# EAGLE design PCB-PWR-DIST (EAGLE 6.2)
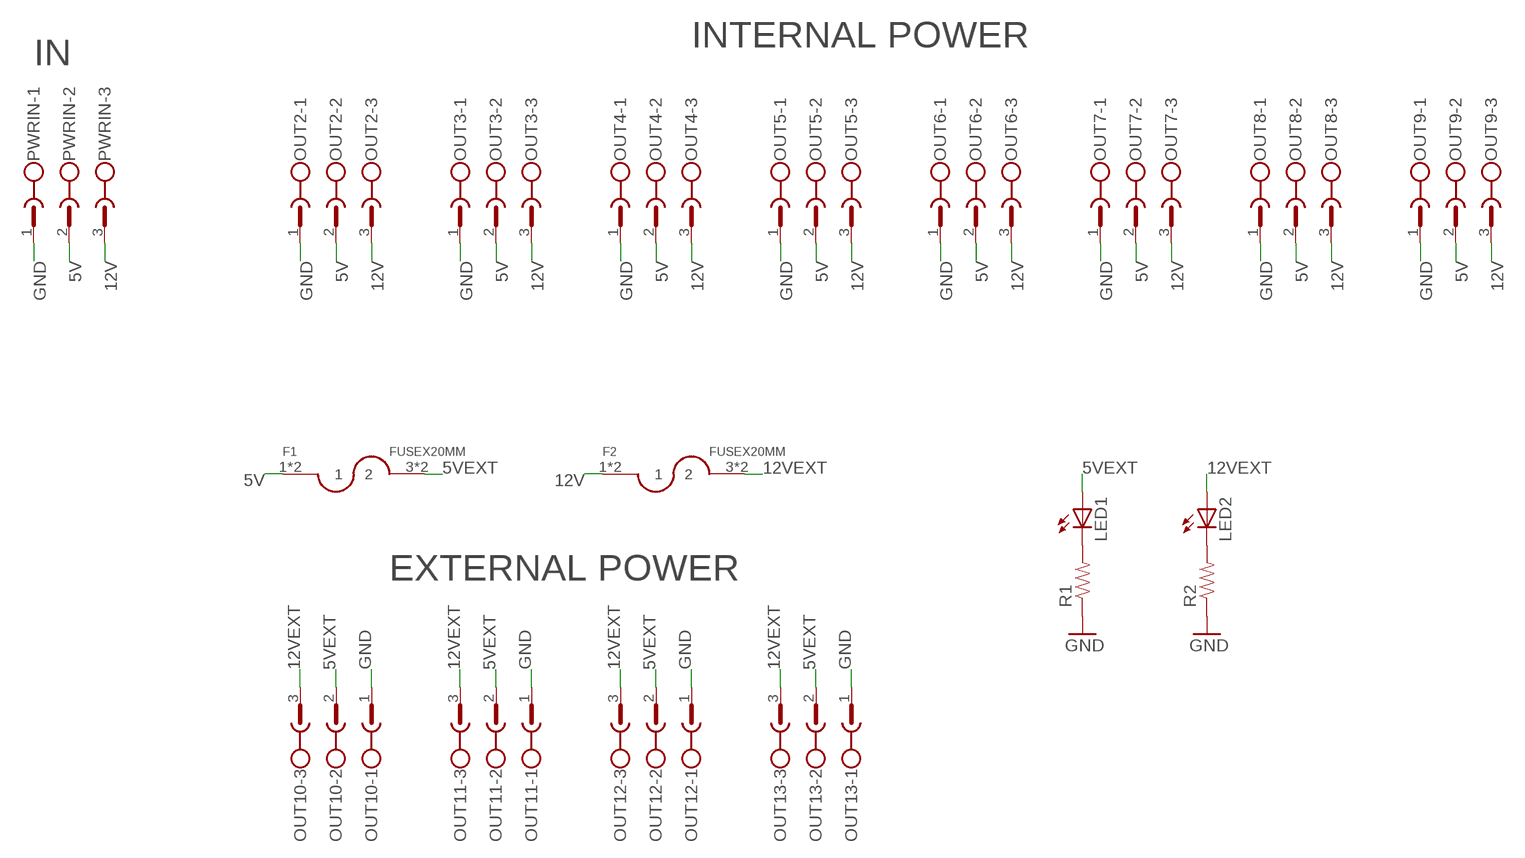
[diagram p0: schematic, sheet 1]

## Parts
F1  FUSEX20MM  [FUSE_5MM]
F2  FUSEX20MM  [FUSE_5MM]
LED1  LED3MM  [LED3MM]
LED2  LED3MM  [LED3MM]
OUT2  CON1  MSTBV3  [MSTBV3]
OUT3  CON1  MSTBV3  [MSTBV3]
OUT4  CON1  MSTBV3  [MSTBV3]
OUT5  CON1  MSTBV3  [MSTBV3]
OUT6  CON1  MSTBV3  [MSTBV3]
OUT7  CON1  MSTBV3  [MSTBV3]
OUT8  CON1  MSTBV3  [MSTBV3]
OUT9  CON1  MSTBV3  [MSTBV3]
OUT10  CON1  MSTBV3  [MSTBV3]
OUT11  CON1  MSTBV3  [MSTBV3]
OUT12  CON1  MSTBV3  [MSTBV3]
OUT13  CON1  MSTBV3  [MSTBV3]
PWRIN  CON1  MSTBV3  [MSTBV3]
R1  RESISTORPTH-1/4W  [AXIAL-0.4]
R2  RESISTORPTH-1/4W  [AXIAL-0.4]

## Nets
5V [PWR]: F1.1 F1.2 OUT2.2 OUT3.2 OUT4.2 OUT5.2 OUT6.2 OUT7.2 OUT8.2 OUT9.2 PWRIN.2
5VEXT [PWR]: F1.3 F1.4 LED1.A OUT10.2 OUT11.2 OUT12.2 OUT13.2
12V [PWR]: F2.1 F2.2 OUT2.3 OUT3.3 OUT4.3 OUT5.3 OUT6.3 OUT7.3 OUT8.3 OUT9.3 PWRIN.3
12VEXT [PWR]: F2.3 F2.4 LED2.A OUT10.3 OUT11.3 OUT12.3 OUT13.3
GND [PWR]: OUT2.1 OUT3.1 OUT4.1 OUT5.1 OUT6.1 OUT7.1 OUT8.1 OUT9.1 OUT10.1 OUT11.1 OUT12.1 OUT13.1 PWRIN.1 R1.P$1 R2.P$1
N$1: LED1.K(C) R1.P$2
N$2: LED2.K(C) R2.P$2

## Notes on the sheet
- INTERNAL POWER
- IN
- EXTERNAL POWER

## Library data of the parts
F1 F2 = SKAARHOJ:FUSE
LED1 LED2 = SparkFun:LED: LEDs Standard schematic elements and footprints for 5mm, 3mm, 1206, and 0603 sized LEDs. 5mm - Spark Fun Electronics SKU : COM-00529 (and others)
OUT2-OUT13 PWRIN = con-phoenix-508:MSTBV3: PHOENIX; MPN: MSTBV 2,5/3-GF-5.08; OC_FARNELL: 1792793; OC_NEWARK: 69R9846
R1 R2 = SparkFun:RESISTOR: Resistor Basic schematic elements and footprints for 0603, 1206, and PTH resistors.

## Net classes
0 default: width 0.254 mm, drill 0.406 mm, clearance 0.254 mm
1 PWR: width 1.778 mm, clearance 0.61 mm

## Board
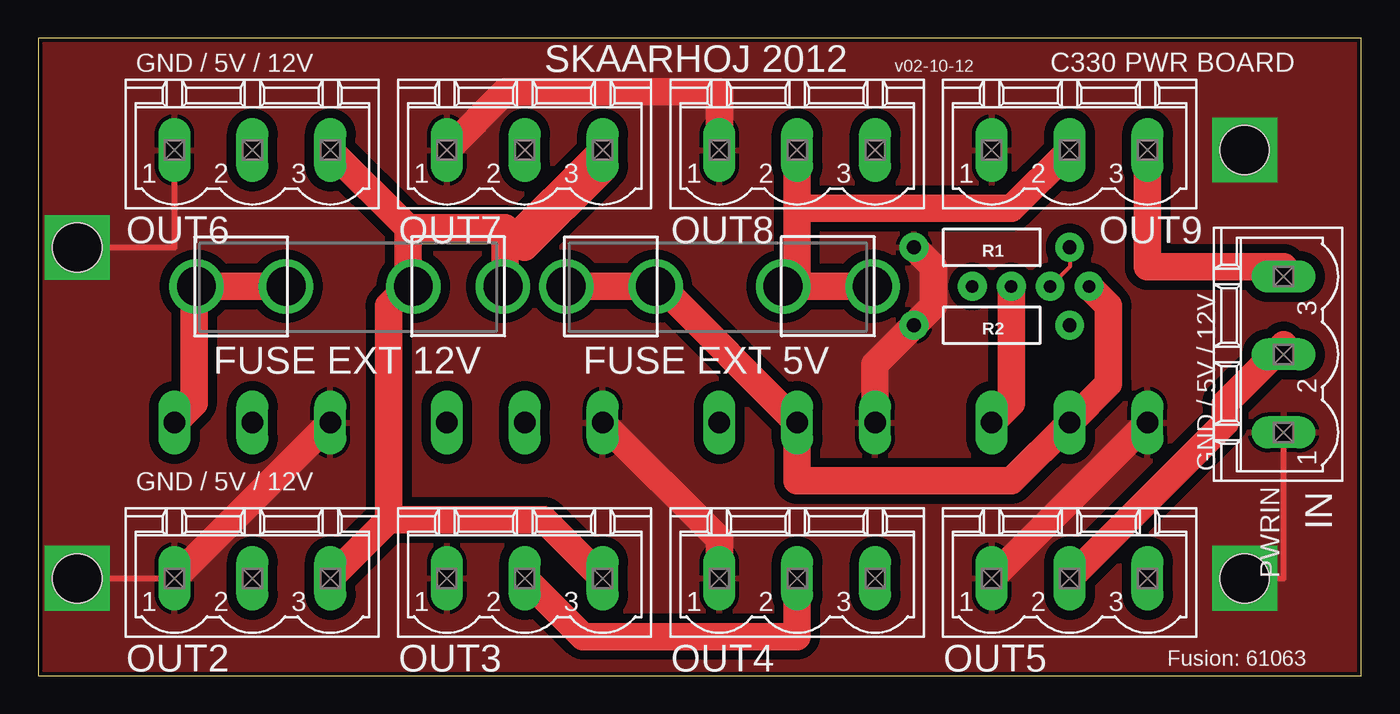
[diagram p1: board, top side]
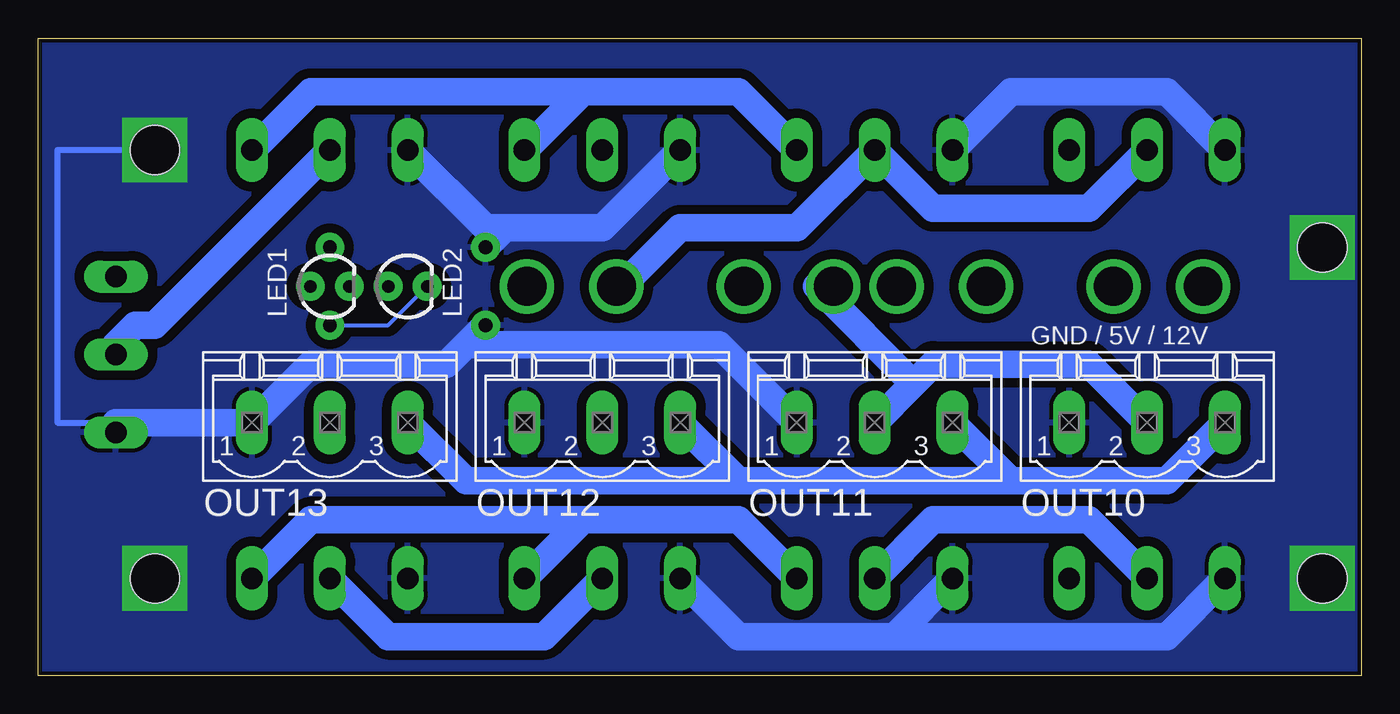
[diagram p2: board, bottom side, seen from below]

Size 86.34 x 41.58 mm. Coordinates in mm from the lower left corner, seen from the top.
Outline: 0,0 86.34,0 86.34,41.58 0,41.58 0,0
Copper layers (1*16): Top 0.035mm / dielectric 1.5mm / Bottom 0.035mm
Design rules: minimum track width 6mil, minimum drill 12mil, track to track 6mil, track to pad 6mil, pad to pad 6mil, via to via 6mil, smd to smd 0mil, copper to edge 10mil, drill to drill 10mil, minimum pad ring 10mil, minimum via ring 6mil, stop-mask expansion 2mil, vias tented up to drill 100mil, thermal gap 10mil
Holes 3.2 mm at 2.54,6.35 78.74,6.35 2.54,27.94 78.74,34.29

### Footprints (pad centres in the part's own frame; a part is rotated, then mirrored left to right if it is on the bottom)
FUSE_5MM = drill 2.54 pad 3.556: 1 0,-10; 2 0,-4.158; 3 0,4.158; 4 0,10
LED3MM = drill 0.813 pad 1.88: A -1.27,0; K 1.27,0
MSTBV3 = drill 1.397 long: 1 -5.08,0; 2 0,0; 3 5.08,0
AXIAL-0.4 = drill 0.9 pad 1.88: P$1 -5.08,0; P$2 5.08,0

### Placement (x,y rotation side)
F1  44.45,25.4 90 top
F2  20.32,25.4 90 top
LED1  67.31,25.4 0 bottom
LED2  62.23,25.4 0 bottom
OUT2  13.97,6.35 0 top
OUT3  31.75,6.35 0 top
OUT4  49.53,6.35 0 top
OUT5  67.31,6.35 0 top
OUT6  13.97,34.29 0 top
OUT7  31.75,34.29 0 top
OUT8  49.53,34.29 0 top
OUT9  67.31,34.29 0 top
OUT10  13.97,16.51 0 bottom
OUT11  31.75,16.51 0 bottom
OUT12  49.53,16.51 0 bottom
OUT13  67.31,16.51 0 bottom
PWRIN  81.28,20.95 90 top
R1  62.23,27.94 0 top
R2  62.23,22.86 0 top

### Tracks (layer width: path | path; a pad name or v marks a point on that pad's centre or on a via)
5V
  Top 1.778: OUT3.2 35.56,2.54 49.53,2.54 OUT4.2 | 49.53,25.4 49.53,30.48 | 49.53,30.48 OUT8.2 | 49.53,25.4 F1.1 | 49.53,25.4 F1.2 | OUT9.2 63.5,30.48 49.53,30.48 | OUT5.2 77.47,16.51 77.47,17.78 81.28,21.59 PWRIN.2
  Bottom 1.778: OUT2.2 17.78,10.16 27.94,10.16 OUT3.2 | OUT4.2 53.34,2.54 63.5,2.54 OUT5.2 | OUT9.2 78.74,22.86 80.01,22.86 81.28,21.59 PWRIN.2 | OUT6.2 17.78,30.48 27.94,30.48 OUT7.2 36.83,29.21 44.45,29.21 48.26,25.4 F1.2
5VEXT
  Top 1.778: LED1.A 69.85,24.13 69.85,19.05 OUT13.2 63.5,12.7 49.53,12.7 OUT12.2 40.64,25.4 F1.3 F1.4
  Bottom 1.778: OUT10.2 17.78,20.32 27.94,20.32 29.21,19.05 | OUT11.2 29.21,19.05 | 29.21,19.05 35.56,25.4 F1.4
12V
  Top 1.778: OUT9.3 72.39,26.67 81.28,26.67 PWRIN.3 | F2.1 30.48,25.4 30.48,27.94 OUT7.3 36.83,33.02 31.75,27.94 30.48,29.21 24.13,29.21 | 22.86,10.16 OUT2.3 | 22.86,10.16 22.86,24.13 24.13,25.4 | 24.13,29.21 OUT6.3 | 24.13,25.4 24.13,29.21 | 24.13,25.4 F2.2 | OUT3.3 33.02,10.16 22.86,10.16
  Bottom 1.778: 50.8,38.1 OUT8.3 | 50.8,38.1 40.64,38.1 OUT7.3 | OUT9.3 68.58,38.1 50.8,38.1 | 50.8,10.16 OUT4.3 | 50.8,10.16 40.64,10.16 OUT3.3 | OUT5.3 68.58,10.16 50.8,10.16
12VEXT
  Top 1.778: LED2.A 63.5,17.78 OUT13.3 | OUT10.3 10.16,17.78 10.16,25.4 F2.4 F2.3
  Bottom 1.778: 22.86,12.7 OUT11.3 | 22.86,12.7 12.7,12.7 OUT10.3 | 40.64,12.7 OUT12.3 | 22.86,12.7 40.64,12.7 | OUT13.3 58.42,12.7 40.64,12.7
GND  (via drill 3.2)
  Top 0.406: v2.54,27.94 8.89,27.94 OUT6.1 | v2.54,6.35 OUT2.1 | v78.74,6.35 81.28,6.35 PWRIN.1
  Top 1.778: OUT10.1 OUT2.1 | OUT11.1 44.45,8.89 OUT4.1 | OUT13.1 OUT5.1 | OUT12.1 54.61,20.32 R2.P$1 58.42,24.13 58.42,26.67 R1.P$1 | OUT7.1 30.48,38.1 44.45,38.1 OUT8.1
  Bottom 0.406: v78.74,34.29 85.09,34.29 85.09,16.51 81.28,16.51
  Bottom 1.778: 30.48,2.54 OUT3.1 | 30.48,2.54 40.64,2.54 OUT4.1 | OUT2.1 12.7,2.54 30.48,2.54 | PWRIN.1 81.28,16.51 OUT13.1 68.58,20.32 59.69,20.32 58.42,21.59 | OUT6.1 12.7,38.1 22.86,38.1 OUT7.1 | OUT8.1 49.53,29.21 55.88,29.21 | R1.P$1 55.88,29.21 | OUT9.1 57.15,29.21 55.88,29.21 | R2.P$1 58.42,21.59 | OUT11.1 41.91,21.59 58.42,21.59
  pour Top: 0,0 0,41.91 86.36,41.91 86.36,0
  pour Bottom: 0,0 0,41.91 86.36,41.91 86.36,0
N$1
  Top 0.254: LED1.K 67.31,26.67 R1.P$2
N$2
  Bottom 0.254: LED2.K 63.5,22.86 R2.P$2

### Text on the board
_tsilk: GND / 5V / 12V | SKAARHOJ 2012 | v02-10-12 | C330 PWR BOARD | FUSE EXT 12V | FUSE EXT 5V | GND / 5V / 12V | GND / 5V / 12V | IN | Fusion: 61063
_bsilk: GND / 5V / 12V